# Altium schematic sheet cs301_template.SchDoc
size A4; SheetNumber: 1; SheetTotal: 1
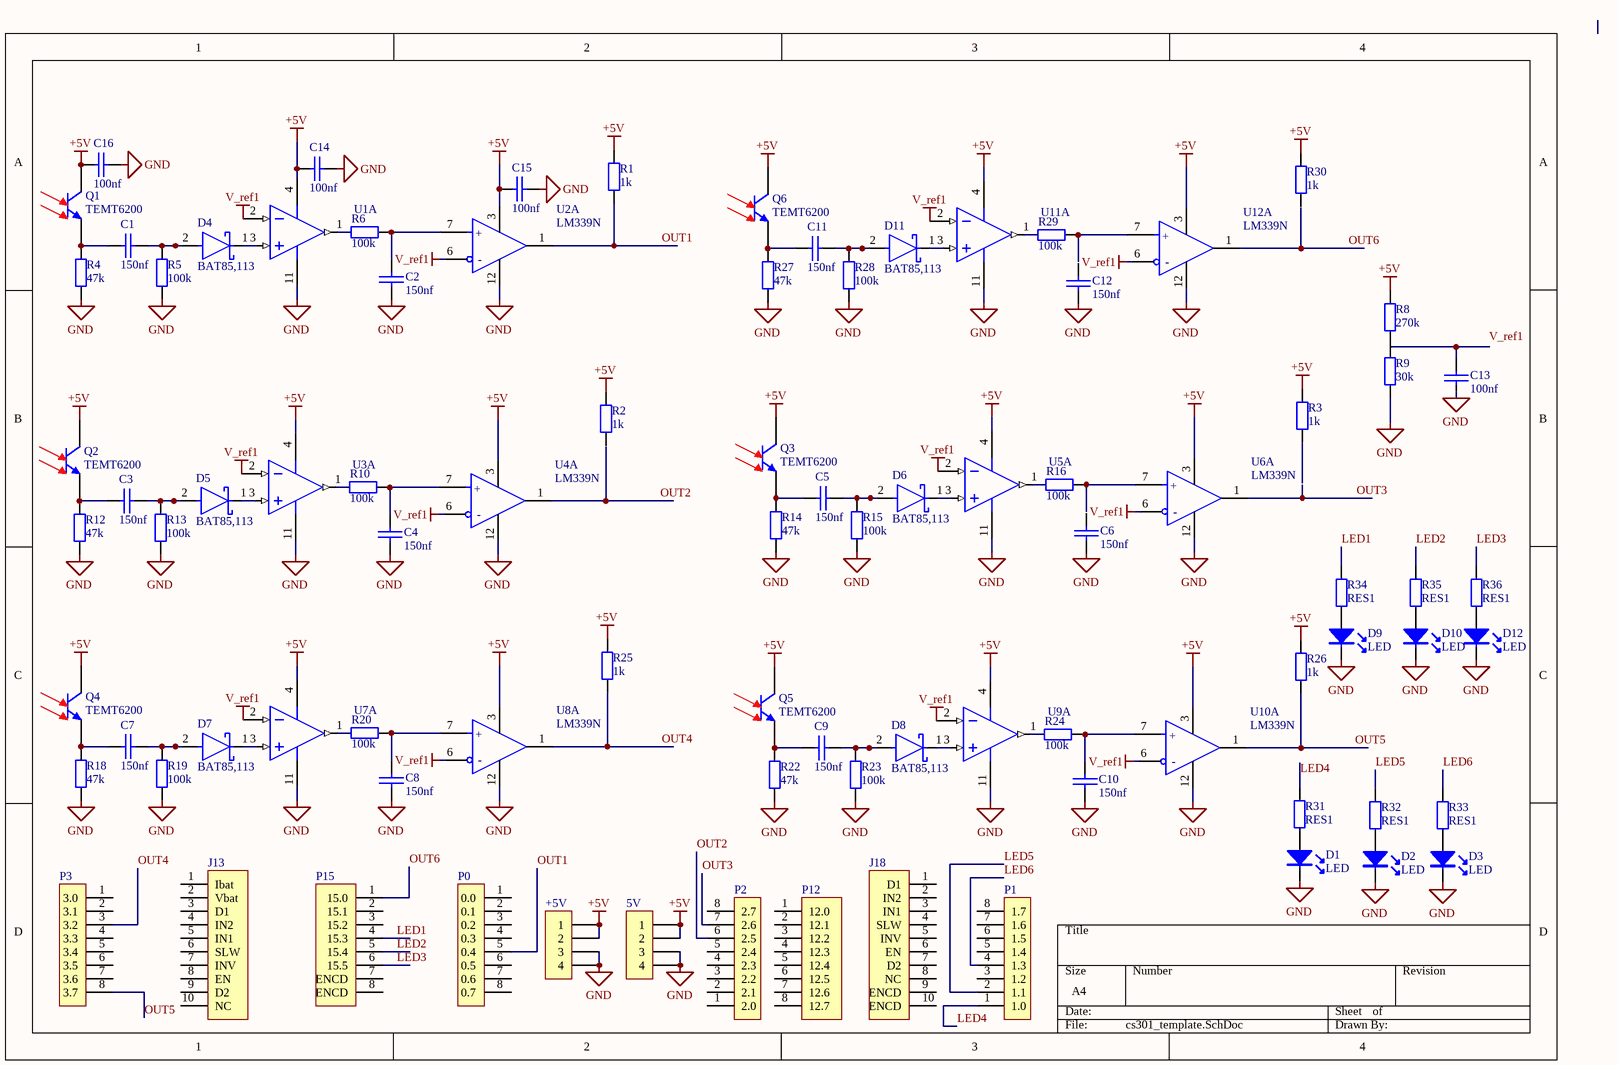
[diagram p0: cs301_template.SchDoc]

## Parts
5V  5V  [IDC4]  (value not drawn)
+5V  5V  [IDC4]  (value not drawn)
C1  150nf  [CCAP-5P0]
C2  150nf  [CCAP-5P0]
C3  150nf  [CCAP-5P0]
C4  150nf  [CCAP-5P0]
C5  150nf  [CCAP-5P0]
C6  150nf  [CCAP-5P0]
C7  150nf  [CCAP-5P0]
C8  150nf  [CCAP-5P0]
C9  150nf  [CCAP-5P0]
C10  150nf  [CCAP-5P0]
C11  150nf  [CCAP-5P0]
C12  150nf  [CCAP-5P0]
C13  100nf  [CCAP-5P0]
C14  100nf  [CCAP-5P0]
C15  100nf  [CCAP-5P0]
C16  100nf  [CCAP-5P0]
D1  LED  [LED0.1/5MM]
D2  LED  [LED0.1/5MM]
D3  LED  [LED0.1/5MM]
D4  BAT85,113  [FP-SOD68-MFG]
D5  BAT85,113  [FP-SOD68-MFG]
D6  BAT85,113  [FP-SOD68-MFG]
D7  BAT85,113  [FP-SOD68-MFG]
D8  BAT85,113  [FP-SOD68-MFG]
D9  LED  [LED0.1/5MM]
D10  LED  [LED0.1/5MM]
D11  BAT85,113  [FP-SOD68-MFG]
D12  LED  [LED0.1/5MM]
J13  CON10  [idc10]  (value not drawn)
J18  CON10  [IDC10]  (value not drawn)
P0  P0  [idc8]  (value not drawn)
P1  P1  [idc8]  (value not drawn)
P2  P2  [idc8]  (value not drawn)
P3  P3  [idc8]  (value not drawn)
P12  P12  [idc8]  (value not drawn)
P15  P15  [idc8]  (value not drawn)
Q1  TEMT6200  [VEMT3700]
Q2  TEMT6200  [VEMT3700]
Q3  TEMT6200  [VEMT3700]
Q4  TEMT6200  [VEMT3700]
Q5  TEMT6200  [VEMT3700]
Q6  TEMT6200  [VEMT3700]
R1  1k  [AXIAL-0.4]
R2  1k  [AXIAL-0.4]
R3  1k  [AXIAL-0.4]
R4  47k  [AXIAL-0.4]
R5  100k  [AXIAL-0.4]
R6  100k  [AXIAL-0.4]
R8  270k  [AXIAL-0.4]
R9  30k  [AXIAL-0.4]
R10  100k  [AXIAL-0.4]
R12  47k  [AXIAL-0.4]
R13  100k  [AXIAL-0.4]
R14  47k  [AXIAL-0.4]
R15  100k  [AXIAL-0.4]
R16  100k  [AXIAL-0.4]
R18  47k  [AXIAL-0.4]
R19  100k  [AXIAL-0.4]
R20  100k  [AXIAL-0.4]
R22  47k  [AXIAL-0.4]
R23  100k  [AXIAL-0.4]
R24  100k  [AXIAL-0.4]
R25  1k  [AXIAL-0.4]
R26  1k  [AXIAL-0.4]
R27  47k  [AXIAL-0.4]
R28  100k  [AXIAL-0.4]
R29  100k  [AXIAL-0.4]
R30  1k  [AXIAL-0.4]
R31  RES1  [AXIAL-0.4]
R32  RES1  [AXIAL-0.4]
R33  RES1  [AXIAL-0.4]
R34  RES1  [AXIAL-0.4]
R35  RES1  [AXIAL-0.4]
R36  RES1  [AXIAL-0.4]
U1  LM324  [DIP-14]  (value not drawn)  (part A of 4)
U2  LM339N  [FP-N0014A-MFG]  (part A of 4)
U3  LM324  [DIP-14]  (value not drawn)  (part A of 4)
U4  LM339N  [FP-N0014A-MFG]  (part A of 4)
U5  LM324  [DIP-14]  (value not drawn)  (part A of 4)
U6  LM339N  [FP-N0014A-MFG]  (part A of 4)
U7  LM324  [DIP-14]  (value not drawn)  (part A of 4)
U8  LM339N  [FP-N0014A-MFG]  (part A of 4)
U9  LM324  [DIP-14]  (value not drawn)  (part A of 4)
U10  LM339N  [FP-N0014A-MFG]  (part A of 4)
U11  LM324  [DIP-14]  (value not drawn)  (part A of 4)
U12  LM339N  [FP-N0014A-MFG]  (part A of 4)

## Nets
+5V: 5V.1 5V.2 +5V.1 +5V.2 C14.1 C15.1 C16.1 Q1.1(C) Q2.1(C) Q3.1(C) Q4.1(C) Q5.1(C) Q6.1(C) R1.2 R2.2 R3.2 R8.1 R25.2 R26.2 R30.2 U1.4(VDD) U2.3(VCC) U3.4(VDD) U4.3(VCC) U5.4(VDD) U6.3(VCC) U7.4(VDD) U8.3(VCC) U9.4(VDD) U10.3(VCC) U11.4(VDD) U12.3(VCC)
GND: 5V.3 5V.4 +5V.3 +5V.4 C2.2 C4.2 C8.2 C10.2 C13.2 C14.2 C15.2 C16.2 D1.K D2.K D3.K D9.K D10.K D12.K R4.1 R5.1 R9.2 R12.1 R13.1 R14.1 R15.1 R18.1 R19.1 R22.1 R23.1 R27.1 R28.1 U1.11(VSS) U2.12(GND) U3.11(VSS) U4.12(GND) U5.11(VSS) U6.12(GND) U7.11(VSS) U8.12(GND) U9.11(VSS) U10.12(GND) U11.11(VSS) U12.12(GND)
V_ref1: U1.2(VINA-) U2.6(1IN-) U3.2(VINA-) U4.6(1IN-) U5.2(VINA-) U6.6(1IN-) U7.2(VINA-) U8.6(1IN-) U9.2(VINA-) U10.6(1IN-) U11.2(VINA-) U12.6(1IN-)
LED1: P15.4(15.3) R34.2
LED2: P15.5(15.4) R35.2
LED3: P15.6(15.5) R36.2
LED4: P1.1(1.0) R31.2
LED5: P1.2(1.1) R32.2
LED6: P1.4(1.3) R33.2
OUT1: P0.5(0.4) R1.1 U2.1(1OUT)
OUT2: P2.6(2.5) U4.1(1OUT)
OUT3: P2.7(2.6) U6.1(1OUT)
OUT4: P3.3(3.2) R25.1 U8.1(1OUT)
OUT5: P3.8(3.7) R26.1 U10.1(1OUT)
OUT6: P15.1(15.0) U12.1(1OUT)
NetC1_1: C1.1 Q1.2(E) R4.2
NetC1_2: C1.2 D4.2(A) R5.2
NetC2_1: C2.1 R6.1 U2.7(1IN+)
NetC3_1: C3.1 Q2.2(E) R12.2
NetC3_2: C3.2 D5.2(A) R13.2
NetC4_1: C4.1 R10.1 U4.7(1IN+)
NetC5_1: C5.1 Q3.2(E) R14.2
NetC5_2: C5.2 D6.2(A) R15.2
NetC7_1: C7.1 Q4.2(E) R18.2
NetC7_2: C7.2 D7.2(A) R19.2
NetC8_1: C8.1 R20.1 U8.7(1IN+)
NetC9_1: C9.1 Q5.2(E) R22.2
NetC9_2: C9.2 D8.2(A) R23.2
NetC10_1: C10.1 R24.1 U10.7(1IN+)
NetC11_1: C11.1 Q6.2(E) R27.2
NetC11_2: C11.2 D11.2(A) R28.2
NetD1_A: D1.A R31.1
NetD2_A: D2.A R32.1
NetD3_A: D3.A R33.1
NetD4_1: D4.1(C) U1.3(VINA+)
NetD5_1: D5.1(C) U3.3(VINA+)
NetD6_1: D6.1(C) U5.3(VINA+)
NetD7_1: D7.1(C) U7.3(VINA+)
NetD8_1: D8.1(C) U9.3(VINA+)
NetD9_A: D9.A R34.1
NetD10_A: D10.A R35.1
NetD11_1: D11.1(C) U11.3(VINA+)
NetD12_A: D12.A R36.1
NetR6_2: R6.2 U1.1(VOUTA)
NetR8_2: R8.2 R9.1
NetR10_2: R10.2 U3.1(VOUTA)
NetR16_1: R16.1 U6.7(1IN+)
NetR16_2: R16.2 U5.1(VOUTA)
NetR20_2: R20.2 U7.1(VOUTA)
NetR24_2: R24.2 U9.1(VOUTA)
NetR29_1: R29.1 U12.7(1IN+)
NetR29_2: R29.2 U11.1(VOUTA)

Not connected (* = marked no-connect by the designer): C6 1 2; C12 1 2; C13 1; J13 1(Ibat) 2(Vbat) 3(D1) 4(IN2) 5(IN1) 6(SLW) 7(INV) 8(EN) 9(D2) 10(NC); J18 1(D1) 2(IN2) 3(IN1) 4(SLW) 5(INV) 6(EN) 7(D2) 8(NC) 9(ENCD) 10(ENCD); P0 1(0.0) 2(0.1) 3(0.2) 4(0.3) 6(0.5) 7(0.6) 8(0.7); P1 3(1.2) 5(1.4) 6(1.5) 7(1.6) 8(1.7); P2 1(2.0) 2(2.1) 3(2.2) 4(2.3) 5(2.4) 8(2.7); P3 1(3.0) 2(3.1) 4(3.3) 5(3.4) 6(3.5) 7(3.6); P12 1(12.0) 2(12.1) 3(12.2) 4(12.3) 5(12.4) 6(12.5) 7(12.6) 8(12.7); P15 2(15.1) 3(15.2) 7(ENCD) 8(ENCD); R2 1; R3 1; R30 1

## Notes on the sheet
- Labels drawn without touching a wire or pin: GND, V_ref1
- (in symbol CMP-0055-00143-4, part A) +; -

## Library data of the parts
5V +5V = CON4: Connector
C1-C16 = CerCap_TH_5P0: TH ceramic capacitor with 5mm pitch; Value: *
D4-D8 D11 = CMP-14398-000042-1: DIODE SCHOTTKY 30V 200MA DO34; RoHS Compliant: Yes
J13 J18 = CON10: Connector
P0-P3 = CON8: Connector
P12 P15 = CON8_1: Connector
Q1-Q6 = VEMT3700: Silicon NPN Phototransistor
R1-R6 R8-R10 R12-R16 R18-R20 R22-R36 = Res_TH_0AX4: Through hole resistor; Published: 8-Jun-2000; LatestRevisionDate: 17-Jul-2002; LatestRevisionNote: Re-released for DXP Platform.; PackageReference: AXIAL-0.4; Publisher: Altium Limited; Value: *; ComponentLink1Description: http://www.royalohm.com/pdf/product2017/PrecisionMetalMF.pdf
U1 U3 U5 U7 U9 U11 = LM324N_TH_DIP16: IC OPAMP GP 14DIP; Manufacturer: ON Semiconductor; Manufacturer Part Number: LM324N; Amplifier Type: General Purpose; Current - Supply: 1mA; Voltage - Supply, Single/Dual (±): 3 V ~ 32 V, ±1.5 V ~ 16 V; Supplier 1: Digi-Key; RoHS: RoHS Compliant; Category: Integrated Circuits (ICs); Stock 1: 2900; Pricing 1: 1=0.9, 10=0.775, 100=0.5789, 500=0.45482, 1000=0.35145 (NZD); Packaging: Tube; Part Status: Active; Output Type: -; Slew Rate: -; Operating Temperature: 0°C ~ 70°C; Mounting Type: Through Hole; Package / Case: 14-DIP (0.300", 7.62mm); Supplier Device Package: 14-DIP; Base Part Number: LM324; ComponentLink1URL: https://www.fairchildsemi.com/datasheets/LM/LM2902.pdf; ComponentLink1Description: https://www.fairchildsemi.com/datasheets/LM/LM2902.pdf; Supplier Part Number 1: LM324NFS-ND
U2 U4 U6 U8 U10 U12 = CMP-0055-00143-4: IC QUAD DIFF COMPARATOR 14-DIP; Power Dissipation: 1.05kW; Response Time: 1.3us; Max Input Current: 250nA; Max Supply Current: 500uA; Output Current: 20mA; Output Type: TTL; Max Dual Supply Voltage: 15V; Voltage Gain: 106.02dB; Min Supply Voltage: 2V; Max Power Dissipation: 1.05W; Quiescent Current: 2.5mA; Nominal Supply Current: 2mA; Input Offset Voltage (Vos): 5mV; Number of Channels: 4; Output Current per Channel: 6mA; Max Supply Voltage: 30V; Min Dual Supply Voltage: 1V; Dual Supply Voltage: 9V; REACH SVHC: No SVHC; Max Operating Temperature: 70°C; Case/Package: PDIP; Weight: 0.032734oz; Radiation Hardening: No; Min Operating Temperature: 0°C; Number of Pins: 14; Contact Plating: Gold; Package Quantity: 25; Lead Free: Lead Free; Height: 4.57mm; Packaging: Rail/Tube; Input Bias Current: 250nA; Number of Elements: 4; Mount: Through Hole; Width: 6.35mm; Length: 19.3mm